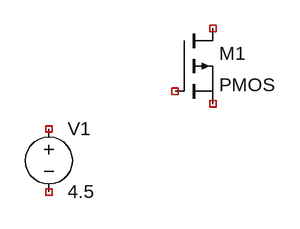
[diagram p0: schematic Draft1.asc]
Draft1.asc, the LTspice schematic file:
Version 4
SHEET 1 880 680
SYMBOL voltage 80 80 R0
WINDOW 123 0 0 Left 0
WINDOW 39 0 0 Left 0
SYMATTR InstName V1
SYMATTR Value 4.5
SYMBOL pmos 240 -32 R0
SYMATTR InstName M1

The netlist it stands for:
* Draft1.asc
V1 NC_01 NC_02 4.5
M1 NC_03 NC_04 NC_05 NC_05 PMOS
.model NMOS NMOS
.model PMOS PMOS
.lib standard.mos
.backanno
.end